# EAGLE schematic LightingModule (EAGLE 6.3)
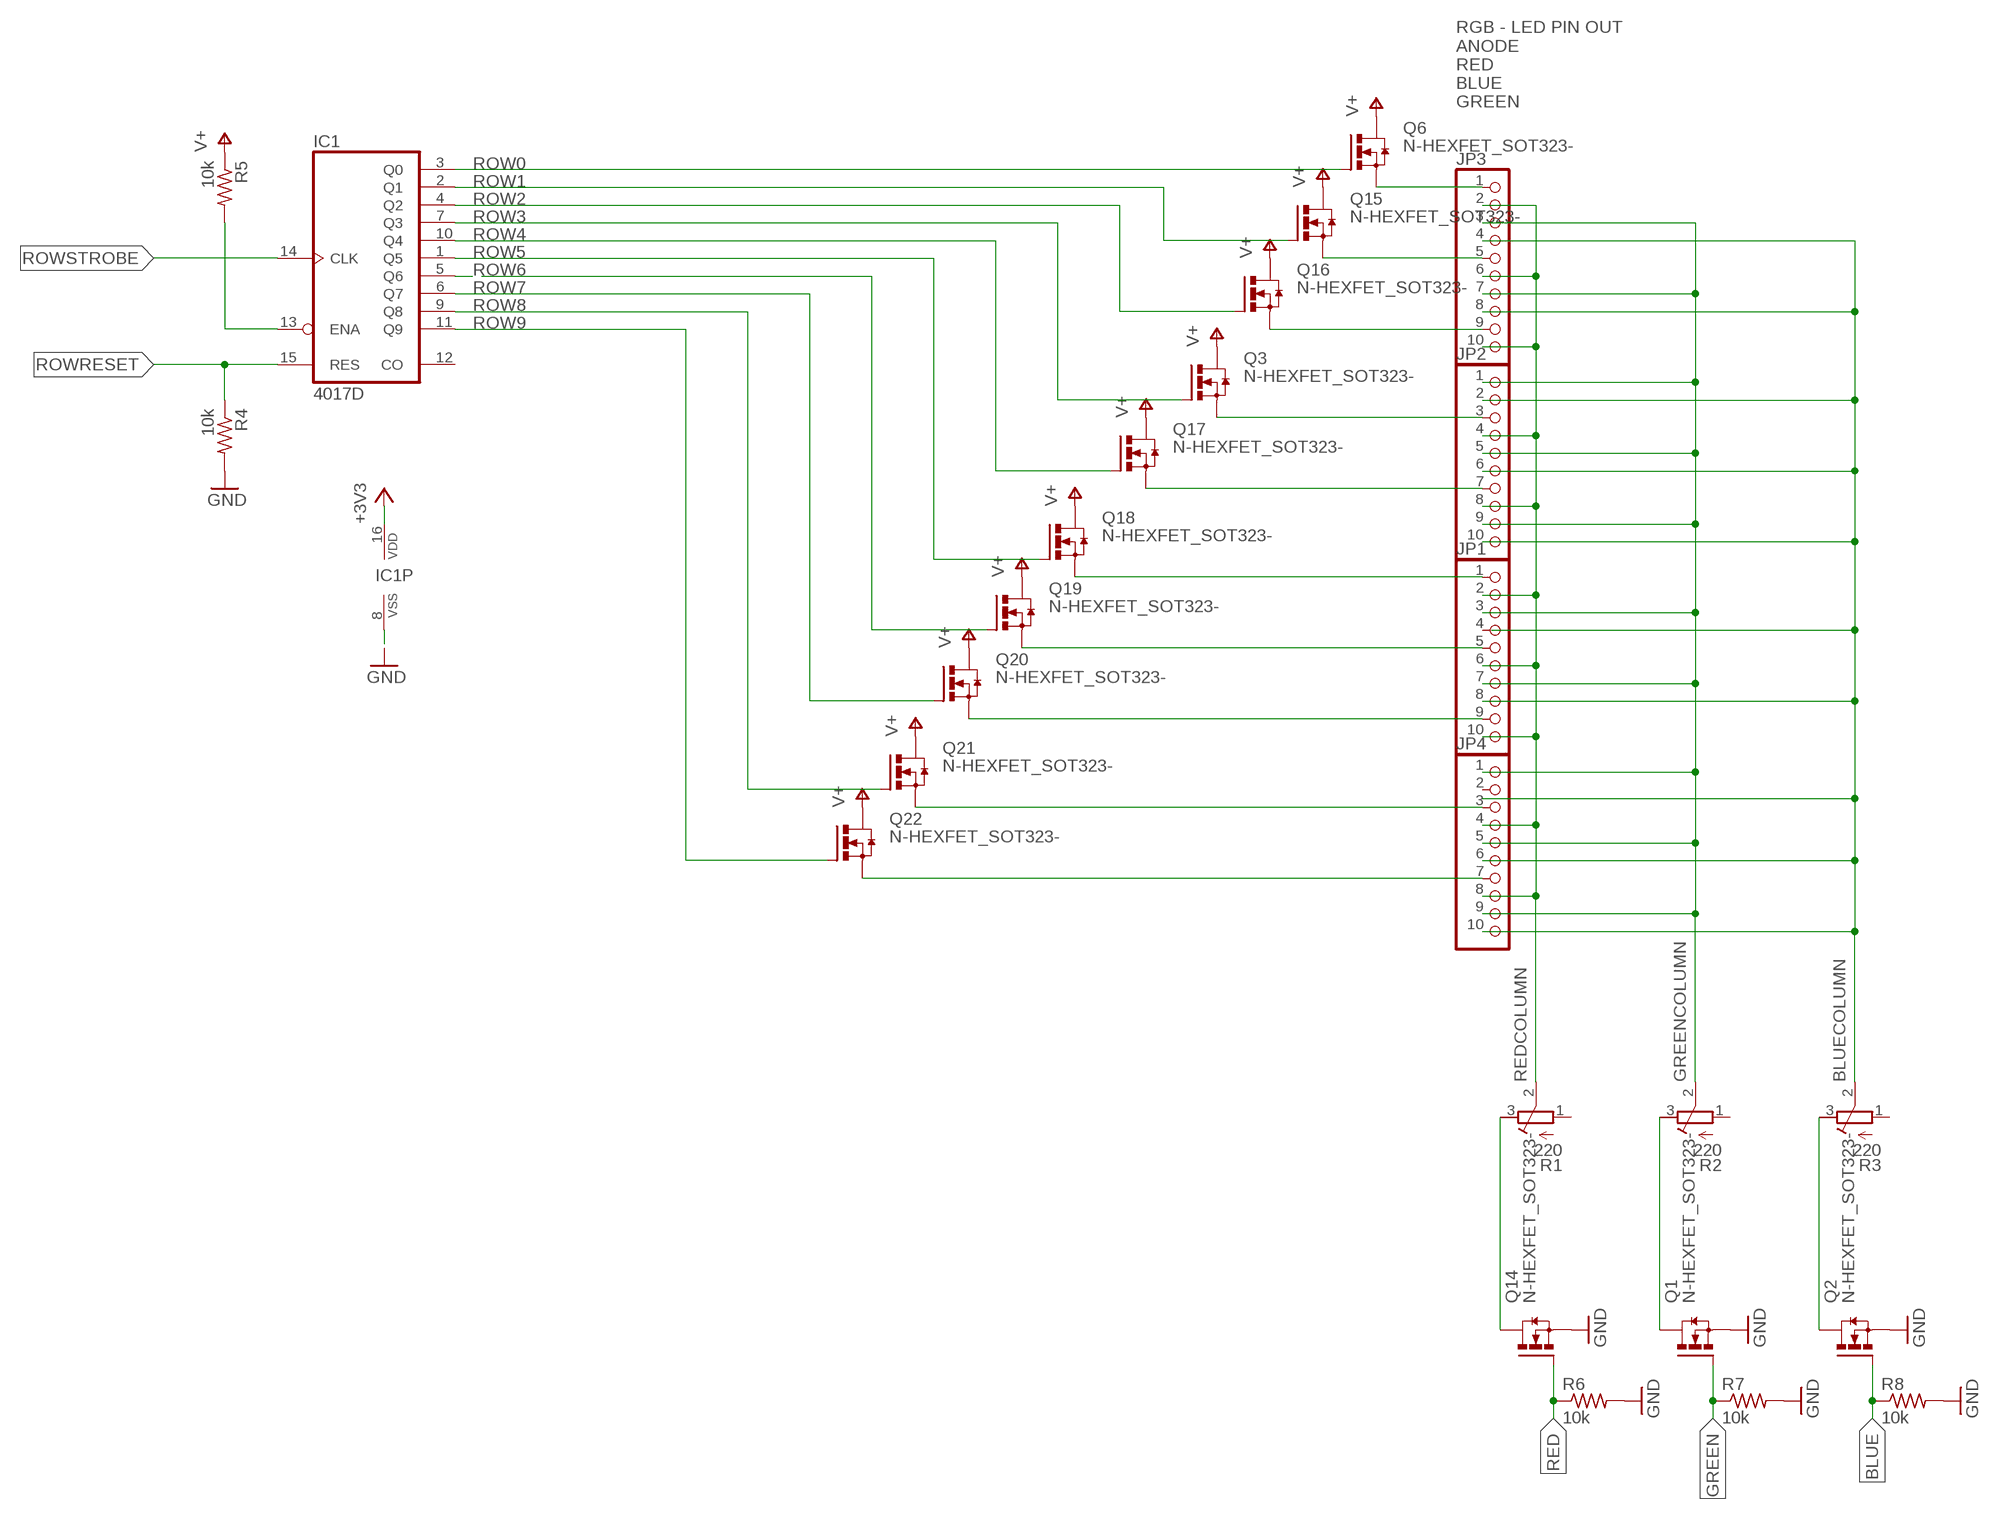
[diagram p0: schematic, sheet 1]

## Parts
IC1  4017D  [SO16]
JP1  PINHD-1X10/90  [1X10/90]
JP2  PINHD-1X10/90  [1X10/90]
JP3  PINHD-1X10/90  [1X10/90]
JP4  PINHD-1X10/90  [1X10/90]
Q1  N-HEXFET_SOT323-  [SOT223]
Q2  N-HEXFET_SOT323-  [SOT223]
Q3  N-HEXFET_SOT323-  [SOT223]
Q6  N-HEXFET_SOT323-  [SOT223]
Q14  N-HEXFET_SOT323-  [SOT223]
Q15  N-HEXFET_SOT323-  [SOT223]
Q16  N-HEXFET_SOT323-  [SOT223]
Q17  N-HEXFET_SOT323-  [SOT223]
Q18  N-HEXFET_SOT323-  [SOT223]
Q19  N-HEXFET_SOT323-  [SOT223]
Q20  N-HEXFET_SOT323-  [SOT223]
Q21  N-HEXFET_SOT323-  [SOT223]
Q22  N-HEXFET_SOT323-  [SOT223]
R1  220  R-TRIMM3374  [RTRIM3374]
R2  220  R-TRIMM3374  [RTRIM3374]
R3  220  R-TRIMM3374  [RTRIM3374]
R4  10k  R-US_M0805  [M0805]
R5  10k  R-US_M0805  [M0805]
R6  10k  R-US_M0805  [M0805]
R7  10k  R-US_M0805  [M0805]
R8  10k  R-US_M0805  [M0805]

## Nets
+3V3: IC1.16(VDD)
BLUE: Q2.1(G) R8.1
BLUECOLUMN: JP1.8 JP2.2 JP2.6 JP2.10 JP3.4 JP3.8 JP4.6 JP4.10 R3.2(S)
GND: IC1.8(VSS) Q1.3(S) Q2.3(S) Q14.3(S) R4.2 R6.2 R7.2 R8.2
GREEN: Q1.1(G) R7.1
GREENCOLUMN: JP1.3 JP1.7 JP2.1 JP2.5 JP2.9 JP3.3 JP3.7 JP4.1 JP4.5 JP4.9 R2.2(S)
N$1: Q14.4(D) R1.3(A)
N$2: Q1.4(D) R2.3(A)
N$3: Q2.4(D) R3.3(A)
N$10: Q19.1(G)
N$14: JP2.3 Q3.3(S)
N$15: JP2.7 Q17.3(S)
N$16: JP3.1 Q6.3(S)
N$17: JP3.5 Q15.3(S)
N$18: JP3.9 Q16.3(S)
N$19: JP1.1 Q18.3(S)
N$20: JP1.5 Q19.3(S)
N$21: JP1.9 Q20.3(S)
N$22: JP4.3 Q21.3(S)
N$23: JP4.7 Q22.3(S)
PA1: IC1.13(ENA) R5.2
RED: Q14.1(G) R6.1
REDCOLUMN: JP1.2 JP1.6 JP1.10 JP2.4 JP2.8 JP3.2 JP3.6 JP3.10 JP4.4 JP4.8 R1.2(S)
ROW0: IC1.3(Q0) Q6.1(G)
ROW1: IC1.2(Q1) Q15.1(G)
ROW2: IC1.4(Q2) Q16.1(G)
ROW3: IC1.7(Q3) Q3.1(G)
ROW4: IC1.10(Q4) Q17.1(G)
ROW5: IC1.1(Q5) Q18.1(G)
ROW6: IC1.5(Q6)
ROW7: IC1.6(Q7) Q20.1(G)
ROW8: IC1.9(Q8) Q21.1(G)
ROW9: IC1.11(Q9) Q22.1(G)
ROWRESET: IC1.15(RES) R4.1
ROWSTROBE: IC1.14(CLK)
V+: Q3.4(D) Q6.4(D) Q15.4(D) Q16.4(D) Q17.4(D) Q18.4(D) Q19.4(D) Q20.4(D) Q21.4(D) Q22.4(D) R5.1
Unconnected: IC1.12(CO) JP1.4 JP4.2 R1.1(E) R2.1(E) R3.1(E)

## Notes on the sheet
- RGB - LED PIN OUT
  ANODE
  RED
  BLUE
  GREEN

## Library data of the parts
IC1 = 40xx:4017: COUNTER/DIVIDER
JP1-JP4 = pinhead:PINHD-1X10: PIN HEADER
Q1-Q3 Q6 Q14-Q22 = transistor-power:N-HEXFET_?-*: HEXFET® Power MOSFET
R1-R3 = resistor:R-TRIMM: Trimm resistor
R4-R8 = resistor:R-US_: RESISTOR, American symbol